# EAGLE schematic ETD555_Project_Schematic (EAGLE 9.7.0)
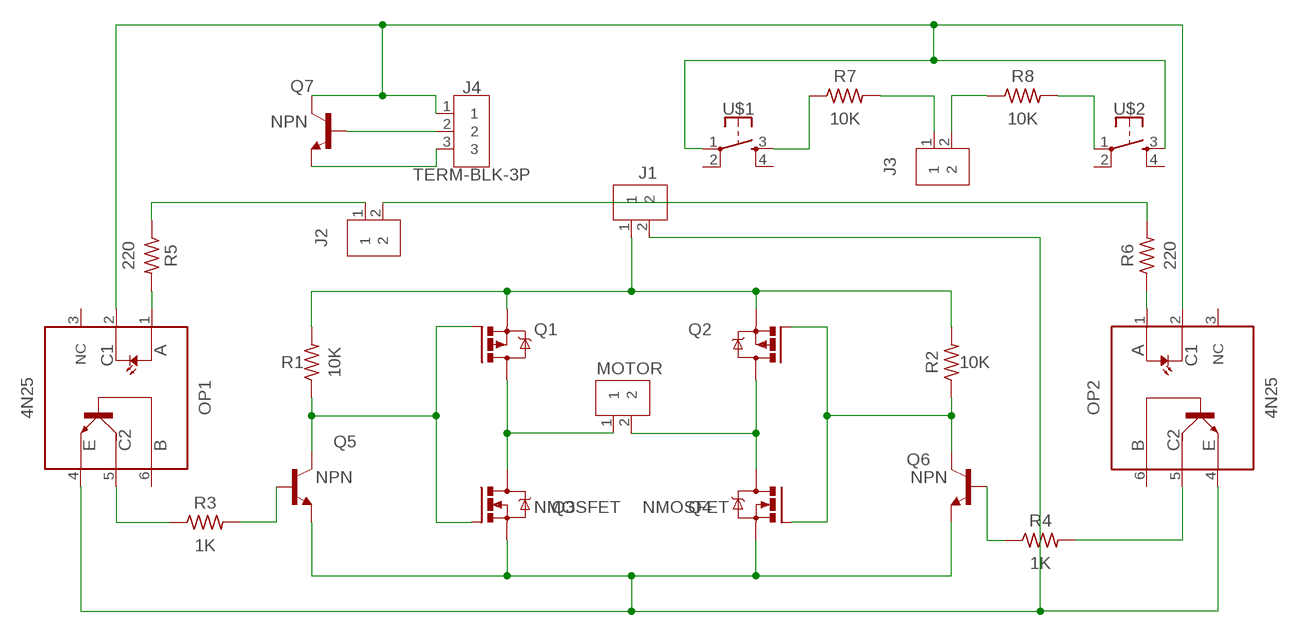
[diagram p0: schematic, sheet 1]

## Parts
J1  TERM-BLK-2P  2828XX-2282837-2  [TERMBLK_508-2N]
J2  TERM-BLK-2P  2828XX-2282837-2  [TERMBLK_508-2N]
J3  TERM-BLK-2P  2828XX-2282837-2  [TERMBLK_508-2N]
J4  TERM-BLK-3P  2828XX-3282834-3  [TERMBLK_254-3N]
MOTOR  TERM-BLK-2P  2828XX-2282837-2  [TERMBLK_508-2N]
OP1  4N25  [DIP762W60P254L712H480Q6B]
OP2  4N25  [DIP762W60P254L712H480Q6B]
Q1  PMOSFET  PMOSFET__TO220  [TO220BV]
Q2  PMOSFET  PMOSFET__TO220  [TO220BV]
Q3  NMOSFET  NMOSFET_TO220  [TO220BV]
Q4  NMOSFET  NMOSFET_TO220  [TO220BV]
Q5  NPN  NPN_TO92-EBC  [TO92]
Q6  NPN  NPN_TO92-EBC  [TO92]
Q7  NPN  NPN_TO92-EBC  [TO92]
R1  10K  R-US_AXIAL-7.2MM-PITCH  [RESAD724W46L381D178B]
R2  10K  R-US_AXIAL-7.2MM-PITCH  [RESAD724W46L381D178B]
R3  1K  R-US_AXIAL-7.2MM-PITCH  [RESAD724W46L381D178B]
R4  1K  R-US_AXIAL-7.2MM-PITCH  [RESAD724W46L381D178B]
R5  220  R-US_AXIAL-7.2MM-PITCH  [RESAD724W46L381D178B]
R6  220  R-US_AXIAL-7.2MM-PITCH  [RESAD724W46L381D178B]
R7  10K  R-US_AXIAL-7.2MM-PITCH  [RESAD724W46L381D178B]
R8  10K  R-US_AXIAL-7.2MM-PITCH  [RESAD724W46L381D178B]
U$1  SWITCH_MOMENTARY  [SWITCH-MOMENTARY-PTH-6.5MM]
U$2  SWITCH_MOMENTARY  [SWITCH-MOMENTARY-PTH-6.5MM]

## Nets
N$1: MOTOR.2 Q2.D Q4.D
N$2: MOTOR.1 Q1.D Q3.D
N$3: J1.1 Q1.S Q2.S R1.2 R2.2
N$4: OP2.1(A) R6.1
N$5: Q1.G Q3.G Q5.3(C) R1.1
N$6: J1.2 OP1.4(E) OP2.4(E) Q3.S Q4.S Q5.1(E) Q6.1(E)
N$7: Q6.2(B) R4.1
N$8: Q5.2(B) R3.2
N$9: Q2.G Q4.G Q6.3(C) R2.1
N$10: J2.1 R5.1
N$11: OP1.5(C2) R3.1
N$12: OP1.1(A) R5.2
N$13: J2.2 R6.2
N$15: J4.2 Q7.2(B)
N$16: J4.1 OP1.2(C1) OP2.2(C1) Q7.3(C) U$1.1 U$2.3
N$17: J4.3 Q7.1(E)
N$18: R7.1 U$1.3
N$19: R8.2 U$2.1
N$20: OP2.5(C2) R4.2
N$21: J3.1 R7.2
N$22: J3.2 R8.1
Unconnected: OP1.3(NC) OP1.6(B) OP2.3(NC) OP2.6(B) U$1.2 U$1.4 U$2.2 U$2.4

## Library data of the parts
J1-J3 MOTOR = Connector:2828XX-2: 2 Position Wire to Board Terminal Block Horizontal with Board Datasheet <https://www.te.com.cn/commerce/DocumentDelivery/DDEController?Action=showdoc&DocId=Catalog+Section%7F1308389_EUROSTYLE_TERMINAL_BLOCKS%7F0607%7Fpdf%7FEnglish%7FENG_CS_1308389_EUROSTYLE_TERMINAL_BLOCKS_0607.pdf%7F2-282837-5>; CATEGORY: Fixed Terminal Blocks; DESCRIPTION: Fixed Terminal Blocks 5.08MM PCB MOUNT 2P; MANUFACTURER: TE Connectivity AMP Connectors; MPN: 282837-2; OPERATING_TEMPERATURE: -40°C to +105°C; PART_STATUS: ACTIVE; PITCH: 0.200" (5.08mm); ROHS_COMPLIANCE: RoHS Compliant; SERIES: Buchanan; SUBCATEGORY: Terminal Blocks; TYPE: Through Hole; Screw - Rising Cage Clamp; Side wire entry, Horizontal with Board
J4 = Connector:2828XX-3: 3 Position Wire to Board Terminal Block Horizontal with Board Datasheet <https://www.te.com.cn/commerce/DocumentDelivery/DDEController?Action=showdoc&DocId=Catalog+Section%7F1308389_EUROSTYLE_TERMINAL_BLOCKS%7F0607%7Fpdf%7FEnglish%7FENG_CS_1308389_EUROSTYLE_TERMINAL_BLOCKS_0607.pdf%7F2-282837-5>; CATEGORY: Fixed Terminal Blocks; DESCRIPTION: Fixed Terminal Blocks 3P TERMINAL BLOCK; MANUFACTURER: TE Connectivity AMP Connectors; MPN: 282834-3; OPERATING_TEMPERATURE: -40°C ~ 105°C; PART_STATUS: Active; PITCH: 0.100" (2.54mm); ROHS_COMPLIANCE: RoHS Compliant; SERIES: Buchanan; SUBCATEGORY: Terminal Blocks; TYPE: Through Hole; Screw - Rising Cage Clamp; Side wire entry, Horizontal with Board
OP1 OP2 = Opto-Electronic:4N: Optocoupler, Phototransistor Output, with Base Connection Datasheet <https://www.vishay.com/docs/83725/4n25.pdf>; CATEGORY: Opto-Electronic; DESCRIPTION: Optoisolator Transistor with Base Output 5000Vrms Channel 6-DIP; MANUFACTURER: Vishay; MPN: 4N25; OPERATING_TEMP: - 55°C to + 100 °C; PART_STATUS: Active; ROHS_COMPLIANT: COMPLIANT; SERIES: 4N2x; SUB-CATEGORY: Optocoupler; THERMALLOSS: 0.150 W
Q1 Q2 = Tinkercad:PMOSFET: P-Channel MOSFET - Generic; CATEGORY: Transistor; SUB-CATEGORY: MOSFET; TYPE: P-Channel
Q3 Q4 = Transistor:NMOSFET: N-Channel MOSFET - Generic; CATEGORY: Transistor; SUB-CATEGORY: MOSFET; TYPE: N-Channel
Q5-Q7 = Transistor:NPN: NPN - Generic; CATEGORY: Transistor; SUB-CATEGORY: BJT; TYPE: NPN
R1-R8 = Resistor:R-US: Resistor Fixed - ANSI; CATEGORY: Resistor; SUB-CATEGORY: Fixed
U$1 U$2 = Tinkercad:SWITCH_MOMENTARY